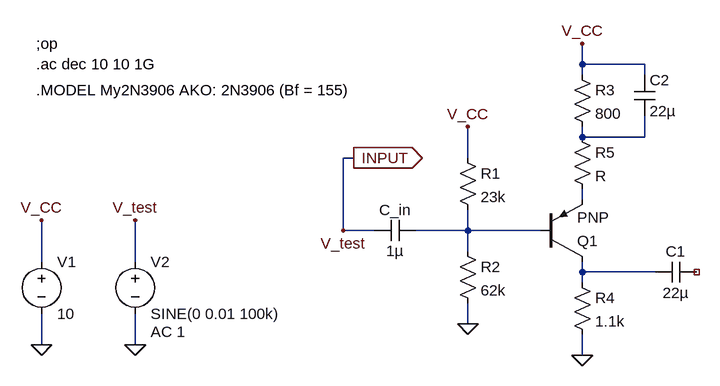
[diagram p0: schematic S3_PNP_CE.asc]
S3_PNP_CE.asc, the LTspice schematic file:
Version 4
SHEET 1 880 680
WIRE 256 -48 256 -80
WIRE 352 -48 256 -48
WIRE 256 -32 256 -48
WIRE 352 -32 352 -48
WIRE 256 64 256 48
WIRE 352 64 352 32
WIRE 352 64 256 64
WIRE -96 96 -112 96
WIRE 80 96 80 48
WIRE 256 160 256 144
WIRE -112 208 -112 96
WIRE -64 208 -112 208
WIRE 80 208 80 176
WIRE 80 208 0 208
WIRE 192 208 80 208
WIRE 80 240 80 208
WIRE -576 256 -576 192
WIRE -432 256 -432 192
WIRE 256 272 256 256
WIRE 368 272 256 272
WIRE 256 288 256 272
WIRE 80 352 80 320
WIRE -576 384 -576 336
WIRE -432 384 -432 336
WIRE 256 400 256 368
FLAG 80 352 0
FLAG -432 384 0
FLAG -576 384 0
FLAG -576 192 V_CC
FLAG -432 192 V_test
FLAG -96 96 INPUT
IOPIN -96 96 Out
FLAG 80 48 V_CC
FLAG -112 208 V_test
FLAG 256 -80 V_CC
FLAG 256 400 0
SYMBOL pnp 192 256 M180
SYMATTR InstName Q1
SYMBOL res 64 80 R0
SYMATTR InstName R1
SYMATTR Value 23k
SYMBOL res 64 224 R0
SYMATTR InstName R2
SYMATTR Value 62k
SYMBOL cap 0 192 R90
WINDOW 0 0 32 VBottom 2
WINDOW 3 32 32 VTop 2
SYMATTR InstName C_in
SYMATTR Value 1µ
SYMBOL voltage -576 240 R0
SYMATTR InstName V1
SYMATTR Value 10
SYMBOL voltage -432 240 R0
WINDOW 123 24 124 Left 2
WINDOW 39 0 0 Left 0
SYMATTR Value2 AC 1
SYMATTR InstName V2
SYMATTR Value SINE(0 0.01 100k)
SYMBOL res 240 -48 R0
SYMATTR InstName R3
SYMATTR Value 800
SYMBOL res 240 272 R0
SYMATTR InstName R4
SYMATTR Value 1.1k
SYMBOL cap 432 256 R90
WINDOW 0 0 32 VBottom 2
WINDOW 3 32 32 VTop 2
SYMATTR InstName C1
SYMATTR Value 22µ
SYMBOL cap 336 -32 R0
SYMATTR InstName C2
SYMATTR Value 22µ
SYMBOL res 240 48 R0
SYMATTR InstName R5
TEXT -584 -8 Left 2 !.MODEL My2N3906 AKO: 2N3906 (Bf = 155)
TEXT -584 -48 Left 2 !.ac dec 10 10 1G
TEXT -584 -80 Left 2 !;op

The netlist it stands for:
* S3_PNP_CE.asc
Q1 N004 N003 N002 0 PNP
R1 V_CC N003 23k
R2 N003 0 62k
C_in N003 INPUT 1µ
V1 V_CC 0 10
V2 INPUT 0 SINE(0 0.01 100k) AC 1
R3 V_CC N001 800
R4 N004 0 1.1k
C1 NC_01 N004 22µ
C2 V_CC N001 22µ
R5 N001 N002 R
.model NPN NPN
.model PNP PNP
.lib standard.bjt
.MODEL My2N3906 AKO: 2N3906 (Bf = 155)
.ac dec 10 10 1G
;op
.backanno
.end